# Altium schematic sheet 24-UltrasonicSensors (SRF05).SchDoc
size A4
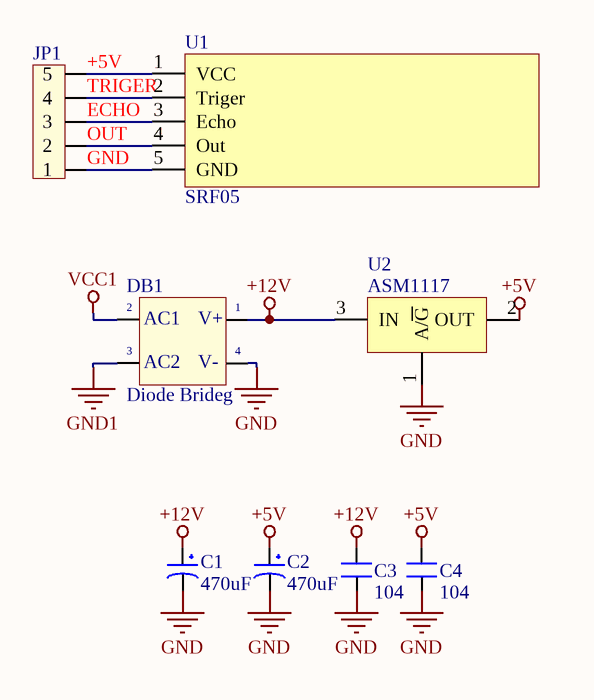
[diagram p0: 24-UltrasonicSensors (SRF05).SchDoc]

## Parts
C1  470uF  [C-ALU-D6.5]
C2  470uF  [C-ALU-D6.5]
C3  104  [C-0805]
C4  104  [C-0805]
DB1  Diode Brideg  [D-DB-1A-SMD]
JP1  JP5  [JP5]  (value not drawn)
U1  SRF05
U2  ASM1117  [TO-252]

## Nets
+5V: C2.1 C4.2 JP1.5 U1.1(VCC) U2.2(OUT)
+12V: C1.1 C3.2 DB1.3(AC2) U2.3(IN)
GND: C1.2 C2.2 C3.1 C4.1 DB1.4(-V_OUT) JP1.1 U1.5(GND) U2.1(A/~{G})
GND1: DB1.1(+V_OUT)
VCC1: DB1.2(AC1)
ECHO: JP1.3 U1.3(Echo)
OUT: JP1.2 U1.4(Out)
TRIGER: JP1.4 U1.2(Triger)

## Notes on the sheet
- (in symbol DB) V+; V-

## Library data of the parts
C1 C2 = CP1: Cap P  0,1uF < 22uF , 16 - 50V; Value: 10uF/50V; Description 1: 10 => 220uF/6,3V/10V - 10uF => 100uF/16V; Description 2: 0,1uF => 33uF/50V - 10uF => 22uF/63V; Description 3: 0,47uF => 10uF/100V
C3 C4 = CN: Value: 0,1uF/300V; Designed by: VanDungEvn
DB1 = DB: Convert AC to DC voltage, 4 pin; Value: Cau 1A